# Altium schematic sheet schematic.SchDoc
size A4; SheetNumber: 6; SheetTotal: 29
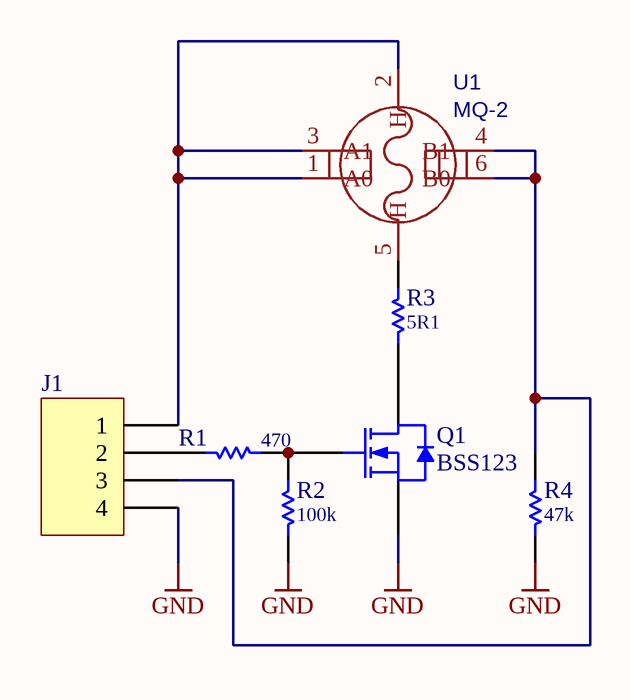
[diagram p0: schematic.SchDoc]

## Parts
J1  532610471  [CONN_MOLEX_532610471]  (value not drawn)
Q1  BSS123  [SOT-23]
R1  470  [R0603]
R2  100k  [R0603]
R3  5R1  [R1206]
R4  47k  [R1206]
U1  MQ-2  [SENSOR-TH_MQ-2]

## Nets
GND: J1.4 Q1.2(SOURCE) R2.2 R4.2
NetJ1_1: J1.1 U1.1(A0) U1.2(H) U1.3(A1)
NetJ1_2: J1.2 R1.2
NetJ1_3: J1.3 R4.1 U1.4(B1) U1.6(B0)
NetQ1_1: Q1.1(GATE) R1.1 R2.1
NetQ1_3: Q1.3(DRAIN) R3.2
NetR3_1: R3.1 U1.5(H)

## Library data of the parts
J1 = Header 3
Q1 = 2N7002
R1 = RES: 470 0603
R2 = RES: 100k 0603
R3 = RES: 5R1 1206
R4 = RES: 47k 1206